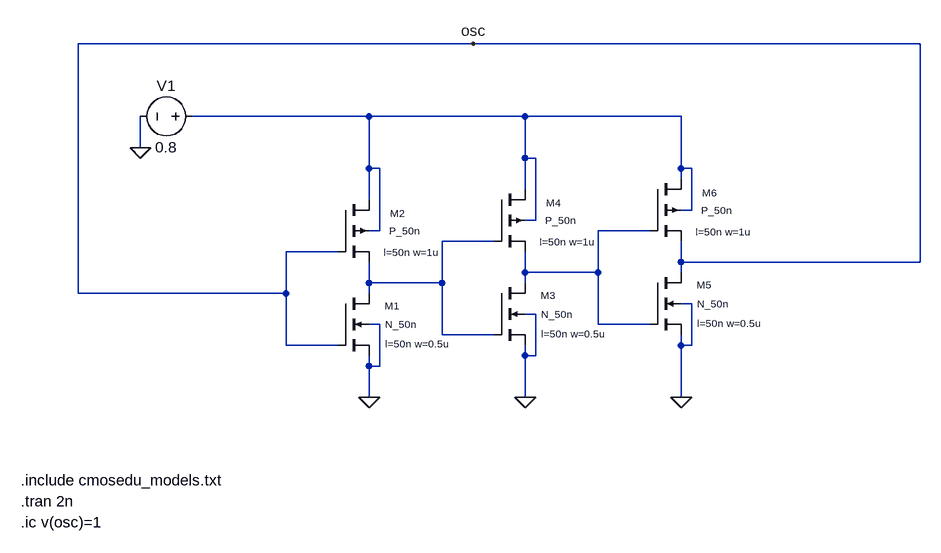
[diagram p0: schematic 3_inverters.asc]
3_inverters.asc, the LTspice schematic file:
Version 4
SHEET 1 1444 680
WIRE 528 -336 -80 -336
WIRE 1216 -336 528 -336
WIRE 368 -224 96 -224
WIRE 608 -224 368 -224
WIRE 848 -224 608 -224
WIRE 16 -176 16 -224
WIRE 608 -160 608 -224
WIRE 624 -160 608 -160
WIRE 368 -144 368 -224
WIRE 384 -144 368 -144
WIRE 848 -144 848 -224
WIRE 864 -144 848 -144
WIRE 848 -128 848 -144
WIRE 608 -112 608 -160
WIRE 368 -96 368 -144
WIRE 864 -80 864 -144
WIRE 864 -80 848 -80
WIRE 624 -64 624 -160
WIRE 624 -64 608 -64
WIRE 384 -48 384 -144
WIRE 384 -48 368 -48
WIRE 800 -48 720 -48
WIRE 560 -32 480 -32
WIRE 320 -16 240 -16
WIRE 848 0 848 -32
WIRE 1216 0 1216 -336
WIRE 1216 0 848 0
WIRE 608 16 608 -16
WIRE 720 16 720 -48
WIRE 720 16 608 16
WIRE 848 16 848 0
WIRE 368 32 368 0
WIRE 480 32 480 -32
WIRE 480 32 368 32
WIRE 608 32 608 16
WIRE -80 48 -80 -336
WIRE 240 48 240 -16
WIRE 240 48 -80 48
WIRE 368 48 368 32
WIRE 864 64 848 64
WIRE 624 80 608 80
WIRE 384 96 368 96
WIRE 720 96 720 16
WIRE 800 96 720 96
WIRE 480 112 480 32
WIRE 560 112 480 112
WIRE 240 128 240 48
WIRE 320 128 240 128
WIRE 848 128 848 112
WIRE 864 128 864 64
WIRE 864 128 848 128
WIRE 608 144 608 128
WIRE 624 144 624 80
WIRE 624 144 608 144
WIRE 368 160 368 144
WIRE 384 160 384 96
WIRE 384 160 368 160
WIRE 368 208 368 160
WIRE 608 208 608 144
WIRE 848 208 848 128
FLAG 528 -336 osc
FLAG 368 208 0
FLAG 608 208 0
FLAG 848 208 0
FLAG 16 -176 0
SYMBOL nmos4 320 48 R0
WINDOW 0 72 19 Left 1
WINDOW 3 73 48 Left 1
WINDOW 123 73 78 Left 1
SYMATTR InstName M1
SYMATTR Value N_50n
SYMATTR Value2 l=50n w=0.5u
SYMBOL pmos4 320 -96 R0
WINDOW 0 80 21 Left 1
WINDOW 3 79 48 Left 1
WINDOW 123 70 81 Left 1
SYMATTR InstName M2
SYMATTR Value P_50n
SYMATTR Value2 l=50n w=1u
SYMBOL nmos4 560 32 R0
WINDOW 0 72 19 Left 1
WINDOW 3 73 48 Left 1
WINDOW 123 73 78 Left 1
SYMATTR InstName M3
SYMATTR Value N_50n
SYMATTR Value2 l=50n w=0.5u
SYMBOL pmos4 560 -112 R0
WINDOW 0 80 21 Left 1
WINDOW 3 79 48 Left 1
WINDOW 123 70 81 Left 1
SYMATTR InstName M4
SYMATTR Value P_50n
SYMATTR Value2 l=50n w=1u
SYMBOL nmos4 800 16 R0
WINDOW 0 72 19 Left 1
WINDOW 3 73 48 Left 1
WINDOW 123 73 78 Left 1
SYMATTR InstName M5
SYMATTR Value N_50n
SYMATTR Value2 l=50n w=0.5u
SYMBOL pmos4 800 -128 R0
WINDOW 0 80 21 Left 1
WINDOW 3 79 48 Left 1
WINDOW 123 70 81 Left 1
SYMATTR InstName M6
SYMATTR Value P_50n
SYMATTR Value2 l=50n w=1u
SYMBOL voltage 112 -224 R90
WINDOW 0 -32 56 VBottom 2
WINDOW 3 32 56 VTop 2
SYMATTR InstName V1
SYMATTR Value 0.8
TEXT -168 336 Left 2 !.include cmosedu_models.txt
TEXT -168 368 Left 2 !.tran 2n
TEXT -168 400 Left 2 !.ic v(osc)=1

The netlist it stands for:
* 3_inverters.asc
M1 N003 osc 0 0 N_50n l=50n w=0.5u
M2 N001 osc N003 N001 P_50n l=50n w=1u
M3 N002 N003 0 0 N_50n l=50n w=0.5u
M4 N001 N003 N002 N001 P_50n l=50n w=1u
M5 osc N002 0 0 N_50n l=50n w=0.5u
M6 N001 N002 osc N001 P_50n l=50n w=1u
V1 N001 0 0.8
.model NMOS NMOS
.model PMOS PMOS
.lib standard.mos
.include cmosedu_models.txt
.tran 2n
.ic v(osc)=1
.backanno
.end